# Altium schematic sheet Scheme.SchDoc
size A4
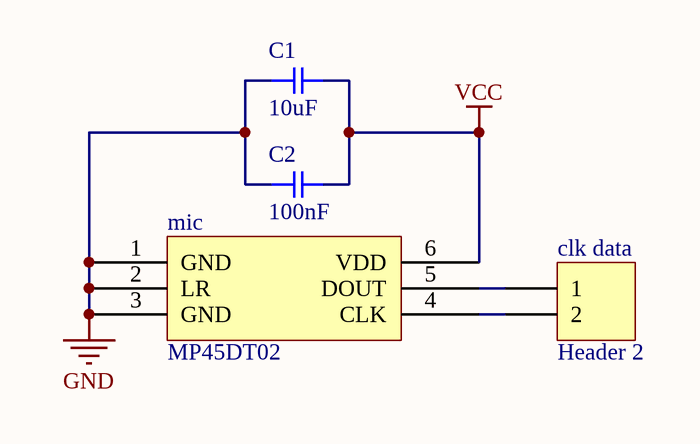
[diagram p0: Scheme.SchDoc]

## Parts
C1  10uF  [SMD-0805C]
C2  100nF  [SMD-0805C]
clk_data  Header 2  [HDR1X2]
mic  MP45DT02  [HLGA6L]

## Nets
GND: C1.1 C2.1 mic.1(GND) mic.2(LR) mic.3(GND)
VCC: C1.2 C2.2 mic.6(VDD)
Netclk_data_1: clk_data.1 mic.5(DOUT)
Netclk_data_2: clk_data.2 mic.4(CLK)

## Library data of the parts
C1 C2 = CAPACITOR: CAP MLCC SMT
clk_data = Header 2: Header, 2-Pin; LatestRevisionDate: 17-Jul-2002; LatestRevisionNote: Re-released for DXP Platform.; Publisher: Altium Limited